# EasyEDA schematic SCH_RFID FCMS Pi Shield_2022-05-20.json
TITLE: RFID FCMS Pi Shield; REV: 1.0; Date: 2022-05-19; Sheet: 1/1; Drawn By: Matthew Murrell
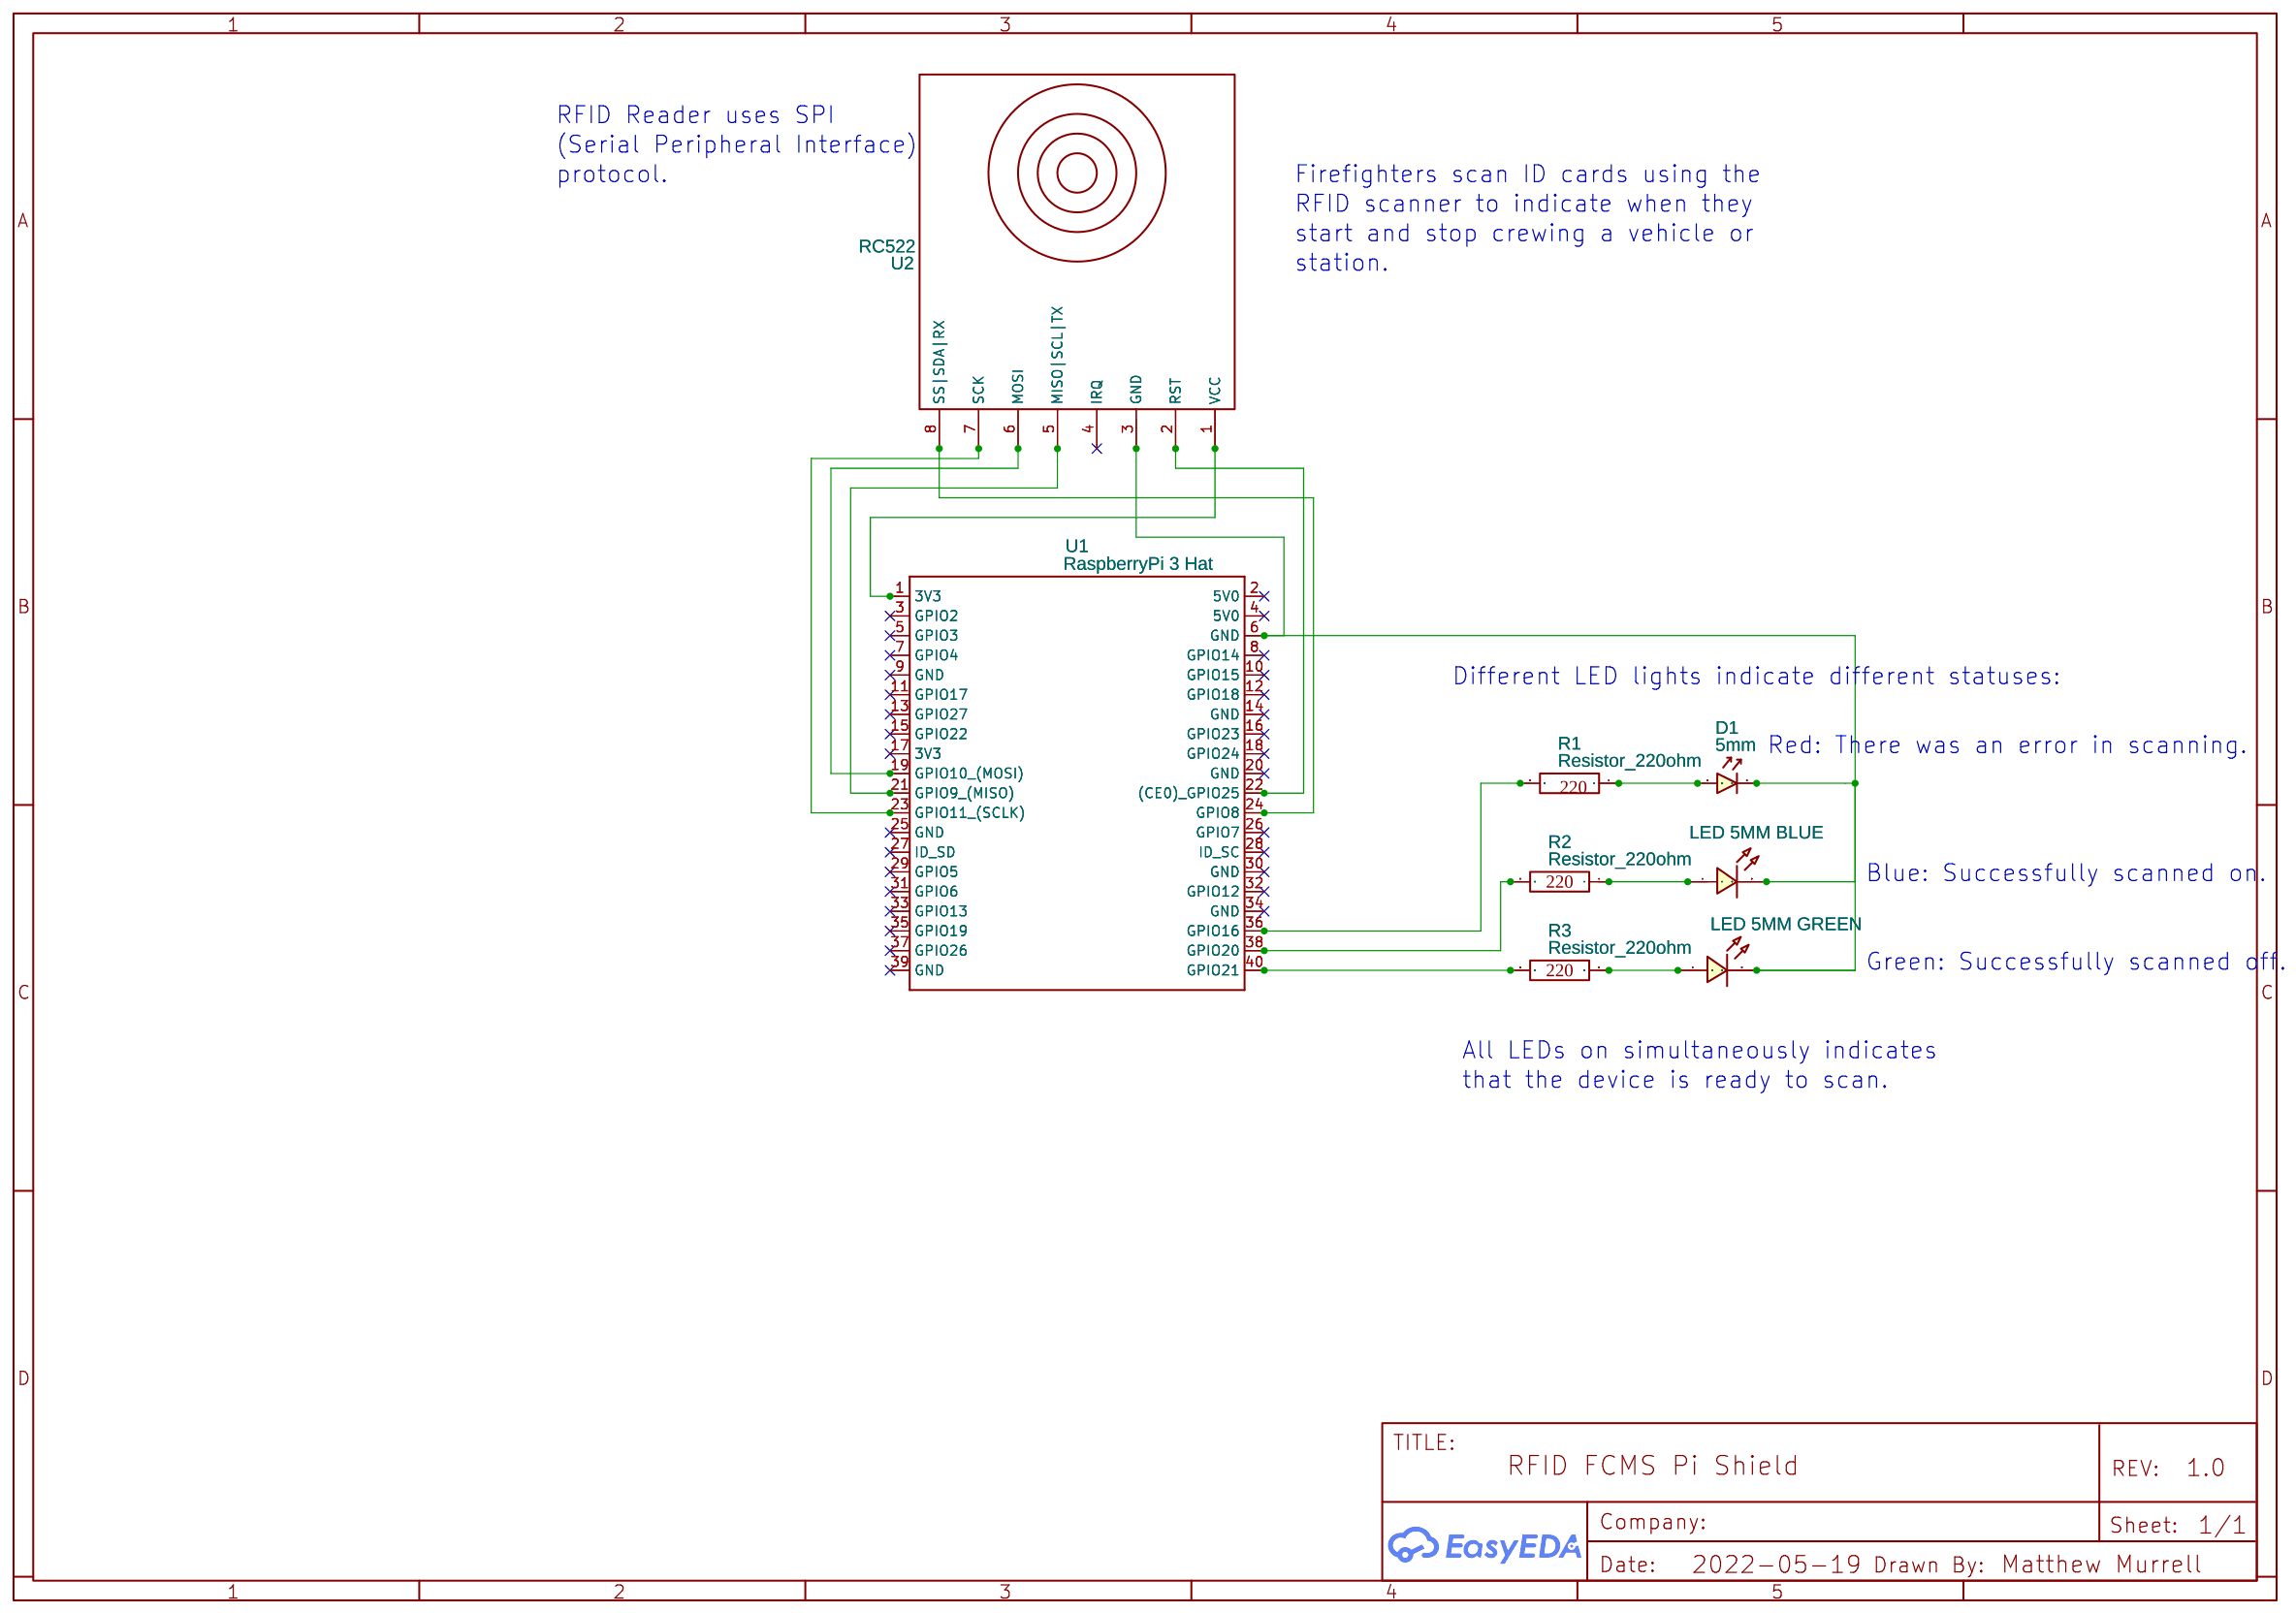
[diagram p0: schematic sheet]

## Parts
1  LED 5MM BLUE  [LED 5MM BLUE]
2  LED 5MM GREEN  [LED 5MM GREEN]
D1  5mm  [PKG-LED-5MM-RED]
R1  Resistor_220ohm  [ER RESISTOR 220OHM]
R2  Resistor_220ohm  [ER RESISTOR 220OHM]
R3  Resistor_220ohm  [ER RESISTOR 220OHM]
U1  RaspberryPi 3 Hat  [RASBERRYPI-3-HAT]
U2  RC522  [RFID-RC522]

## Library data of the parts
1 = LED 5MM BLUE: Contributor: LCSC
2 = LED 5MM GREEN: Contributor: LCSC
D1 = L-1503EC: Color: Red; WaveLength: 617nm; Forward Voltage: 2.0V; Manufacturer: KINGBRIGHT; Supplier Part: 1003201; Supplier: Element14; link: http://www.farnell.com/datasheets/2046493.pdf?_ga=2.91228057.244688081.1505921947-238689616.1505921947&_gac=1.213042848.1505921947.EAIaIQobChMIsdP1s4y01gIVhxwbCh2_CAopEAAYASAAEgKnhPD_BwE; Contributor: Prof. Ing. F. Scordino
R1-R3 = Resistor_220ohm: Supplier: Conrad; Contributor: George Edmonds
U1 = RaspberryPi 3 Hat: Manufacturer Part: RaspberryPi 3; Contributor: lynxlabeling
U2 = RC522: Contributor: edgdsj

## Nets
Net-(1-1): 1.1 R2.1
Net-(1-2): 1.2 2.2 D1.2 U1.6(GND) U2.3(GND)
Net-(2-1): 2.1 R3.1
Net-(D1-1): D1.1 R1.1
Net-(R1-2): R1.2 U1.36(GPIO16)
Net-(R2-2): R2.2 U1.38(GPIO20)
Net-(R3-2): R3.2 U1.40(GPIO21)
Net-(U1-1): U1.1(3V3) U2.1(VCC)
Net-(U1-19): U1.19(GPIO10 (MOSI)) U2.6(MOSI)
Net-(U1-21): U1.21(GPIO9 (MISO)) U2.5(MISO|SCL|TX)
Net-(U1-22): U1.22((CE0) GPIO25) U2.2(RST)
Net-(U1-23): U1.23(GPIO11 (SCLK)) U2.7(SCK)
Net-(U1-24): U1.24(GPIO8) U2.8(SS|SDA|RX)

Not connected (* = marked no-connect by the designer): U1 2(5V0)* 3(GPIO2)* 4(5V0)* 5(GPIO3)* 7(GPIO4)* 8(GPIO14)* 9(GND)* 10(GPIO15)* 11(GPIO17)* 12(GPIO18)* 13(GPIO27)* 14(GND)* 15(GPIO22)* 16(GPIO23)* 17(3V3)* 18(GPIO24)* 20(GND)* 25(GND)* 26(GPIO7)* 27(ID_SD)* 28(ID_SC)* 29(GPIO5)* 30(GND)* 31(GPIO6)* 32(GPIO12)* 33(GPIO13)* 34(GND)* 35(GPIO19)* 37(GPIO26)* 39(GND)*; U2 4(IRQ)*

## Notes on the sheet
- RFID Reader uses SPI
- (Serial Peripheral Interface)
- protocol.
- Firefighters scan ID cards using the
- RFID scanner to indicate when they
- start and stop crewing a vehicle or
- station.
- Different LED lights indicate different statuses:
- Red: There was an error in scanning.
- Blue: Successfully scanned on.
- Green: Successfully scanned off.
- All LEDs on simultaneously indicates
- that the device is ready to scan.
